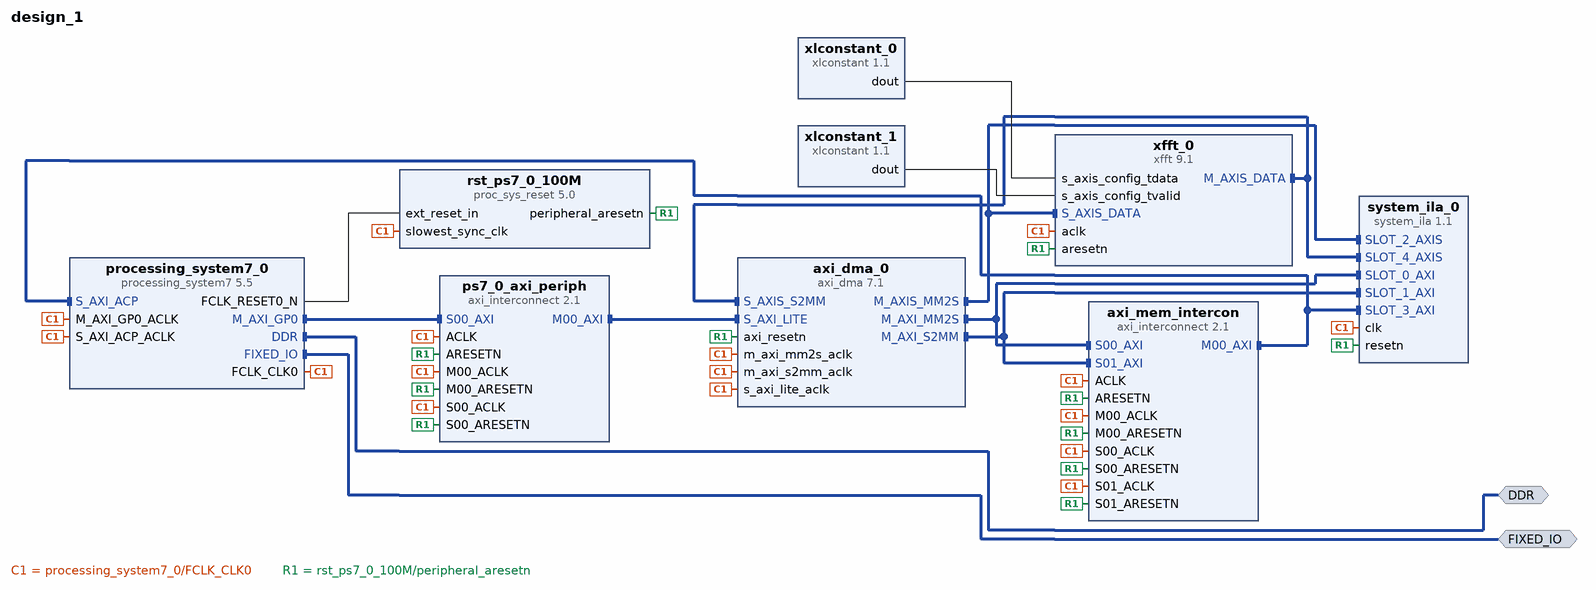
[diagram p0: block diagram of the top level]
# Vivado block design design_1, xc7z020clg484-1, Vivado 2024.2
create_bd_design design_1

create_bd_intf_port -mode Master -vlnv xilinx.com:interface:ddrx_rtl:1.0 DDR
create_bd_intf_port -mode Master -vlnv xilinx.com:display_processing_system7:fixedio_rtl:1.0 FIXED_IO

create_bd_cell -type ip -vlnv xilinx.com:ip:processing_system7:5.5 processing_system7_0
set_property -dict [list \
  CONFIG.PCW_APU_PERIPHERAL_FREQMHZ 666.666667 \
  CONFIG.PCW_ENET0_PERIPHERAL_ENABLE 0 \
  CONFIG.PCW_FPGA0_PERIPHERAL_FREQMHZ 100.000000 \
  CONFIG.PCW_FPGA1_PERIPHERAL_FREQMHZ 150.000000 \
  CONFIG.PCW_FPGA2_PERIPHERAL_FREQMHZ 50.000000 \
  CONFIG.PCW_GPIO_MIO_GPIO_ENABLE 1 \
  CONFIG.PCW_GPIO_MIO_GPIO_IO MIO \
  CONFIG.PCW_I2C_RESET_ENABLE 1 \
  CONFIG.PCW_PERIPHERAL_BOARD_PRESET part0 \
  CONFIG.PCW_PRESET_BANK1_VOLTAGE {LVCMOS 1.8V} \
  CONFIG.PCW_QSPI_PERIPHERAL_ENABLE 0 \
  CONFIG.PCW_SD0_PERIPHERAL_ENABLE 0 \
  CONFIG.PCW_UART1_PERIPHERAL_ENABLE 1 \
  CONFIG.PCW_UART1_UART1_IO {MIO 48 .. 49} \
  CONFIG.PCW_UART_PERIPHERAL_FREQMHZ 50 \
  CONFIG.PCW_UIPARAM_DDR_FREQ_MHZ 533.333313 \
  CONFIG.PCW_UIPARAM_DDR_PARTNO {MT41J128M16 HA-15E} \
  CONFIG.PCW_USB0_PERIPHERAL_ENABLE 0 \
  CONFIG.PCW_USB_RESET_ENABLE 1 \
  CONFIG.PCW_USE_S_AXI_ACP 1 \
  CONFIG.preset ZedBoard \
] [get_bd_cells processing_system7_0]
# 218 more settings of processing_system7_0 are not shown: defaults, MIO pin electricals, DDR timing, and values the tool derives
create_bd_cell -type ip -vlnv xilinx.com:ip:axi_dma:7.1 axi_dma_0
set_property -dict [list \
  CONFIG.c_include_mm2s_dre 1 \
  CONFIG.c_include_s2mm_dre 1 \
  CONFIG.c_include_sg 0 \
  CONFIG.c_m_axi_mm2s_data_width 64 \
  CONFIG.c_m_axi_s2mm_data_width 64 \
  CONFIG.c_m_axis_mm2s_tdata_width 64 \
  CONFIG.c_mm2s_burst_size 256 \
  CONFIG.c_s2mm_burst_size 256 \
] [get_bd_cells axi_dma_0]
create_bd_cell -type ip -vlnv xilinx.com:ip:axi_interconnect:2.1 ps7_0_axi_periph
set_property -dict {CONFIG.NUM_MI 1} [get_bd_cells ps7_0_axi_periph]
create_bd_cell -type ip -vlnv xilinx.com:ip:proc_sys_reset:5.0 rst_ps7_0_100M
create_bd_cell -type ip -vlnv xilinx.com:ip:axi_interconnect:2.1 axi_mem_intercon
set_property -dict {CONFIG.NUM_MI 1 CONFIG.NUM_SI 2} [get_bd_cells axi_mem_intercon]
create_bd_cell -type ip -vlnv xilinx.com:ip:xfft:9.1 xfft_0
set_property -dict [list \
  CONFIG.aresetn true \
  CONFIG.data_format floating_point \
  CONFIG.implementation_options automatically_select \
  CONFIG.input_width 32 \
  CONFIG.number_of_stages_using_block_ram_for_data_and_phase_factors 0 \
  CONFIG.output_ordering natural_order \
  CONFIG.phase_factor_width 24 \
  CONFIG.transform_length 8 \
] [get_bd_cells xfft_0]
create_bd_cell -type ip -vlnv xilinx.com:ip:xlconstant:1.1 xlconstant_0
set_property -dict {CONFIG.CONST_WIDTH 8} [get_bd_cells xlconstant_0]
create_bd_cell -type ip -vlnv xilinx.com:ip:xlconstant:1.1 xlconstant_1
set_property -dict {CONFIG.CONST_WIDTH 1} [get_bd_cells xlconstant_1]
create_bd_cell -type ip -vlnv xilinx.com:ip:system_ila:1.1 system_ila_0
set_property -dict [list \
  CONFIG.C_MON_TYPE INTERFACE \
  CONFIG.C_NUM_MONITOR_SLOTS 5 \
  CONFIG.C_SLOT_0_APC_EN 0 \
  CONFIG.C_SLOT_0_AXI_AR_SEL_DATA 1 \
  CONFIG.C_SLOT_0_AXI_AR_SEL_TRIG 1 \
  CONFIG.C_SLOT_0_AXI_AW_SEL_DATA 1 \
  CONFIG.C_SLOT_0_AXI_AW_SEL_TRIG 1 \
  CONFIG.C_SLOT_0_AXI_B_SEL_DATA 1 \
  CONFIG.C_SLOT_0_AXI_B_SEL_TRIG 1 \
  CONFIG.C_SLOT_0_AXI_R_SEL_DATA 1 \
  CONFIG.C_SLOT_0_AXI_R_SEL_TRIG 1 \
  CONFIG.C_SLOT_0_AXI_W_SEL_DATA 1 \
  CONFIG.C_SLOT_0_AXI_W_SEL_TRIG 1 \
  CONFIG.C_SLOT_0_INTF_TYPE xilinx.com:interface:aximm_rtl:1.0 \
  CONFIG.C_SLOT_1_APC_EN 0 \
  CONFIG.C_SLOT_1_AXI_AR_SEL_DATA 1 \
  CONFIG.C_SLOT_1_AXI_AR_SEL_TRIG 1 \
  CONFIG.C_SLOT_1_AXI_AW_SEL_DATA 1 \
  CONFIG.C_SLOT_1_AXI_AW_SEL_TRIG 1 \
  CONFIG.C_SLOT_1_AXI_B_SEL_DATA 1 \
  CONFIG.C_SLOT_1_AXI_B_SEL_TRIG 1 \
  CONFIG.C_SLOT_1_AXI_R_SEL_DATA 1 \
  CONFIG.C_SLOT_1_AXI_R_SEL_TRIG 1 \
  CONFIG.C_SLOT_1_AXI_W_SEL_DATA 1 \
  CONFIG.C_SLOT_1_AXI_W_SEL_TRIG 1 \
  CONFIG.C_SLOT_1_INTF_TYPE xilinx.com:interface:aximm_rtl:1.0 \
  CONFIG.C_SLOT_2_APC_EN 0 \
  CONFIG.C_SLOT_2_AXI_DATA_SEL 1 \
  CONFIG.C_SLOT_2_AXI_TRIG_SEL 1 \
  CONFIG.C_SLOT_2_INTF_TYPE xilinx.com:interface:axis_rtl:1.0 \
  CONFIG.C_SLOT_3_APC_EN 0 \
  CONFIG.C_SLOT_3_AXI_AR_SEL_DATA 1 \
  CONFIG.C_SLOT_3_AXI_AR_SEL_TRIG 1 \
  CONFIG.C_SLOT_3_AXI_AW_SEL_DATA 1 \
  CONFIG.C_SLOT_3_AXI_AW_SEL_TRIG 1 \
  CONFIG.C_SLOT_3_AXI_B_SEL_DATA 1 \
  CONFIG.C_SLOT_3_AXI_B_SEL_TRIG 1 \
  CONFIG.C_SLOT_3_AXI_R_SEL_DATA 1 \
  CONFIG.C_SLOT_3_AXI_R_SEL_TRIG 1 \
  CONFIG.C_SLOT_3_AXI_W_SEL_DATA 1 \
  CONFIG.C_SLOT_3_AXI_W_SEL_TRIG 1 \
  CONFIG.C_SLOT_3_INTF_TYPE xilinx.com:interface:aximm_rtl:1.0 \
  CONFIG.C_SLOT_4_APC_EN 0 \
  CONFIG.C_SLOT_4_AXI_DATA_SEL 1 \
  CONFIG.C_SLOT_4_AXI_TRIG_SEL 1 \
  CONFIG.C_SLOT_4_INTF_TYPE xilinx.com:interface:axis_rtl:1.0 \
] [get_bd_cells system_ila_0]

# ---- connections ----

connect_bd_intf_net -intf_net axi_dma_0_M_AXIS_MM2S [get_bd_intf_pins axi_dma_0/M_AXIS_MM2S] [get_bd_intf_pins xfft_0/S_AXIS_DATA]
connect_bd_intf_net [get_bd_intf_pins axi_dma_0/M_AXIS_MM2S] [get_bd_intf_pins system_ila_0/SLOT_2_AXIS]
connect_bd_intf_net -intf_net axi_dma_0_M_AXI_MM2S [get_bd_intf_pins axi_dma_0/M_AXI_MM2S] [get_bd_intf_pins axi_mem_intercon/S00_AXI]
connect_bd_intf_net [get_bd_intf_pins axi_dma_0/M_AXI_MM2S] [get_bd_intf_pins system_ila_0/SLOT_0_AXI]
connect_bd_intf_net -intf_net axi_dma_0_M_AXI_S2MM [get_bd_intf_pins axi_dma_0/M_AXI_S2MM] [get_bd_intf_pins axi_mem_intercon/S01_AXI]
connect_bd_intf_net [get_bd_intf_pins axi_dma_0/M_AXI_S2MM] [get_bd_intf_pins system_ila_0/SLOT_1_AXI]
connect_bd_intf_net -intf_net axi_mem_intercon_M00_AXI [get_bd_intf_pins axi_mem_intercon/M00_AXI] [get_bd_intf_pins processing_system7_0/S_AXI_ACP]
connect_bd_intf_net [get_bd_intf_pins axi_mem_intercon/M00_AXI] [get_bd_intf_pins system_ila_0/SLOT_3_AXI]
connect_bd_intf_net [get_bd_intf_ports DDR] [get_bd_intf_pins processing_system7_0/DDR]
connect_bd_intf_net [get_bd_intf_ports FIXED_IO] [get_bd_intf_pins processing_system7_0/FIXED_IO]
connect_bd_intf_net [get_bd_intf_pins processing_system7_0/M_AXI_GP0] [get_bd_intf_pins ps7_0_axi_periph/S00_AXI]
connect_bd_intf_net [get_bd_intf_pins ps7_0_axi_periph/M00_AXI] [get_bd_intf_pins axi_dma_0/S_AXI_LITE]
connect_bd_intf_net -intf_net xfft_0_M_AXIS_DATA [get_bd_intf_pins xfft_0/M_AXIS_DATA] [get_bd_intf_pins axi_dma_0/S_AXIS_S2MM]
connect_bd_intf_net [get_bd_intf_pins xfft_0/M_AXIS_DATA] [get_bd_intf_pins system_ila_0/SLOT_4_AXIS]
connect_bd_net [get_bd_pins processing_system7_0/FCLK_CLK0] \
  [get_bd_pins axi_dma_0/s_axi_lite_aclk] [get_bd_pins axi_dma_0/m_axi_mm2s_aclk] [get_bd_pins axi_dma_0/m_axi_s2mm_aclk] \
  [get_bd_pins axi_mem_intercon/ACLK] [get_bd_pins axi_mem_intercon/S00_ACLK] [get_bd_pins axi_mem_intercon/M00_ACLK] \
  [get_bd_pins axi_mem_intercon/S01_ACLK] [get_bd_pins processing_system7_0/M_AXI_GP0_ACLK] \
  [get_bd_pins processing_system7_0/S_AXI_ACP_ACLK] [get_bd_pins ps7_0_axi_periph/ACLK] \
  [get_bd_pins ps7_0_axi_periph/S00_ACLK] [get_bd_pins ps7_0_axi_periph/M00_ACLK] \
  [get_bd_pins rst_ps7_0_100M/slowest_sync_clk] [get_bd_pins system_ila_0/clk] [get_bd_pins xfft_0/aclk]
connect_bd_net [get_bd_pins processing_system7_0/FCLK_RESET0_N] [get_bd_pins rst_ps7_0_100M/ext_reset_in]
connect_bd_net [get_bd_pins rst_ps7_0_100M/peripheral_aresetn] \
  [get_bd_pins axi_dma_0/axi_resetn] [get_bd_pins axi_mem_intercon/ARESETN] [get_bd_pins axi_mem_intercon/S00_ARESETN] \
  [get_bd_pins axi_mem_intercon/M00_ARESETN] [get_bd_pins axi_mem_intercon/S01_ARESETN] \
  [get_bd_pins ps7_0_axi_periph/ARESETN] [get_bd_pins ps7_0_axi_periph/S00_ARESETN] \
  [get_bd_pins ps7_0_axi_periph/M00_ARESETN] [get_bd_pins system_ila_0/resetn] [get_bd_pins xfft_0/aresetn]
connect_bd_net [get_bd_pins xlconstant_0/dout] [get_bd_pins xfft_0/s_axis_config_tdata]
connect_bd_net [get_bd_pins xlconstant_1/dout] [get_bd_pins xfft_0/s_axis_config_tvalid]
set_property HDL_ATTRIBUTE.DEBUG true [get_bd_intf_nets axi_dma_0_M_AXIS_MM2S]
set_property HDL_ATTRIBUTE.MARK_DEBUG true [get_bd_intf_nets axi_dma_0_M_AXIS_MM2S]
set_property HDL_ATTRIBUTE.DEBUG true [get_bd_intf_nets axi_dma_0_M_AXI_MM2S]
set_property HDL_ATTRIBUTE.MARK_DEBUG true [get_bd_intf_nets axi_dma_0_M_AXI_MM2S]
set_property HDL_ATTRIBUTE.DEBUG true [get_bd_intf_nets axi_dma_0_M_AXI_S2MM]
set_property HDL_ATTRIBUTE.MARK_DEBUG true [get_bd_intf_nets axi_dma_0_M_AXI_S2MM]
set_property HDL_ATTRIBUTE.DEBUG true [get_bd_intf_nets axi_mem_intercon_M00_AXI]
set_property HDL_ATTRIBUTE.MARK_DEBUG true [get_bd_intf_nets axi_mem_intercon_M00_AXI]
set_property HDL_ATTRIBUTE.DEBUG true [get_bd_intf_nets xfft_0_M_AXIS_DATA]
set_property HDL_ATTRIBUTE.MARK_DEBUG true [get_bd_intf_nets xfft_0_M_AXIS_DATA]

# ---- address map ----
assign_bd_address -offset 0x00000000 -range 512M -target_address_space [get_bd_addr_spaces axi_dma_0/Data_MM2S] [get_bd_addr_segs processing_system7_0/S_AXI_ACP/ACP_DDR_LOWOCM]
exclude_bd_addr_seg -offset 0x40000000 -range 1G -target_address_space [get_bd_addr_spaces axi_dma_0/Data_MM2S] [get_bd_addr_segs processing_system7_0/S_AXI_ACP/ACP_M_AXI_GP0]
exclude_bd_addr_seg -offset 0xE0000000 -range 4M -target_address_space [get_bd_addr_spaces axi_dma_0/Data_MM2S] [get_bd_addr_segs processing_system7_0/S_AXI_ACP/ACP_IOP]
assign_bd_address -offset 0x00000000 -range 512M -target_address_space [get_bd_addr_spaces axi_dma_0/Data_S2MM] [get_bd_addr_segs processing_system7_0/S_AXI_ACP/ACP_DDR_LOWOCM]
exclude_bd_addr_seg -offset 0x40000000 -range 1G -target_address_space [get_bd_addr_spaces axi_dma_0/Data_S2MM] [get_bd_addr_segs processing_system7_0/S_AXI_ACP/ACP_M_AXI_GP0]
exclude_bd_addr_seg -offset 0xE0000000 -range 4M -target_address_space [get_bd_addr_spaces axi_dma_0/Data_S2MM] [get_bd_addr_segs processing_system7_0/S_AXI_ACP/ACP_IOP]
assign_bd_address -offset 0x40400000 -range 64K -target_address_space [get_bd_addr_spaces processing_system7_0/Data] [get_bd_addr_segs axi_dma_0/S_AXI_LITE/Reg]

validate_bd_design
save_bd_design
